# Altium schematic sheet PCB Schematic.SchDoc
size B; SheetNumber: 1; SheetTotal: 1
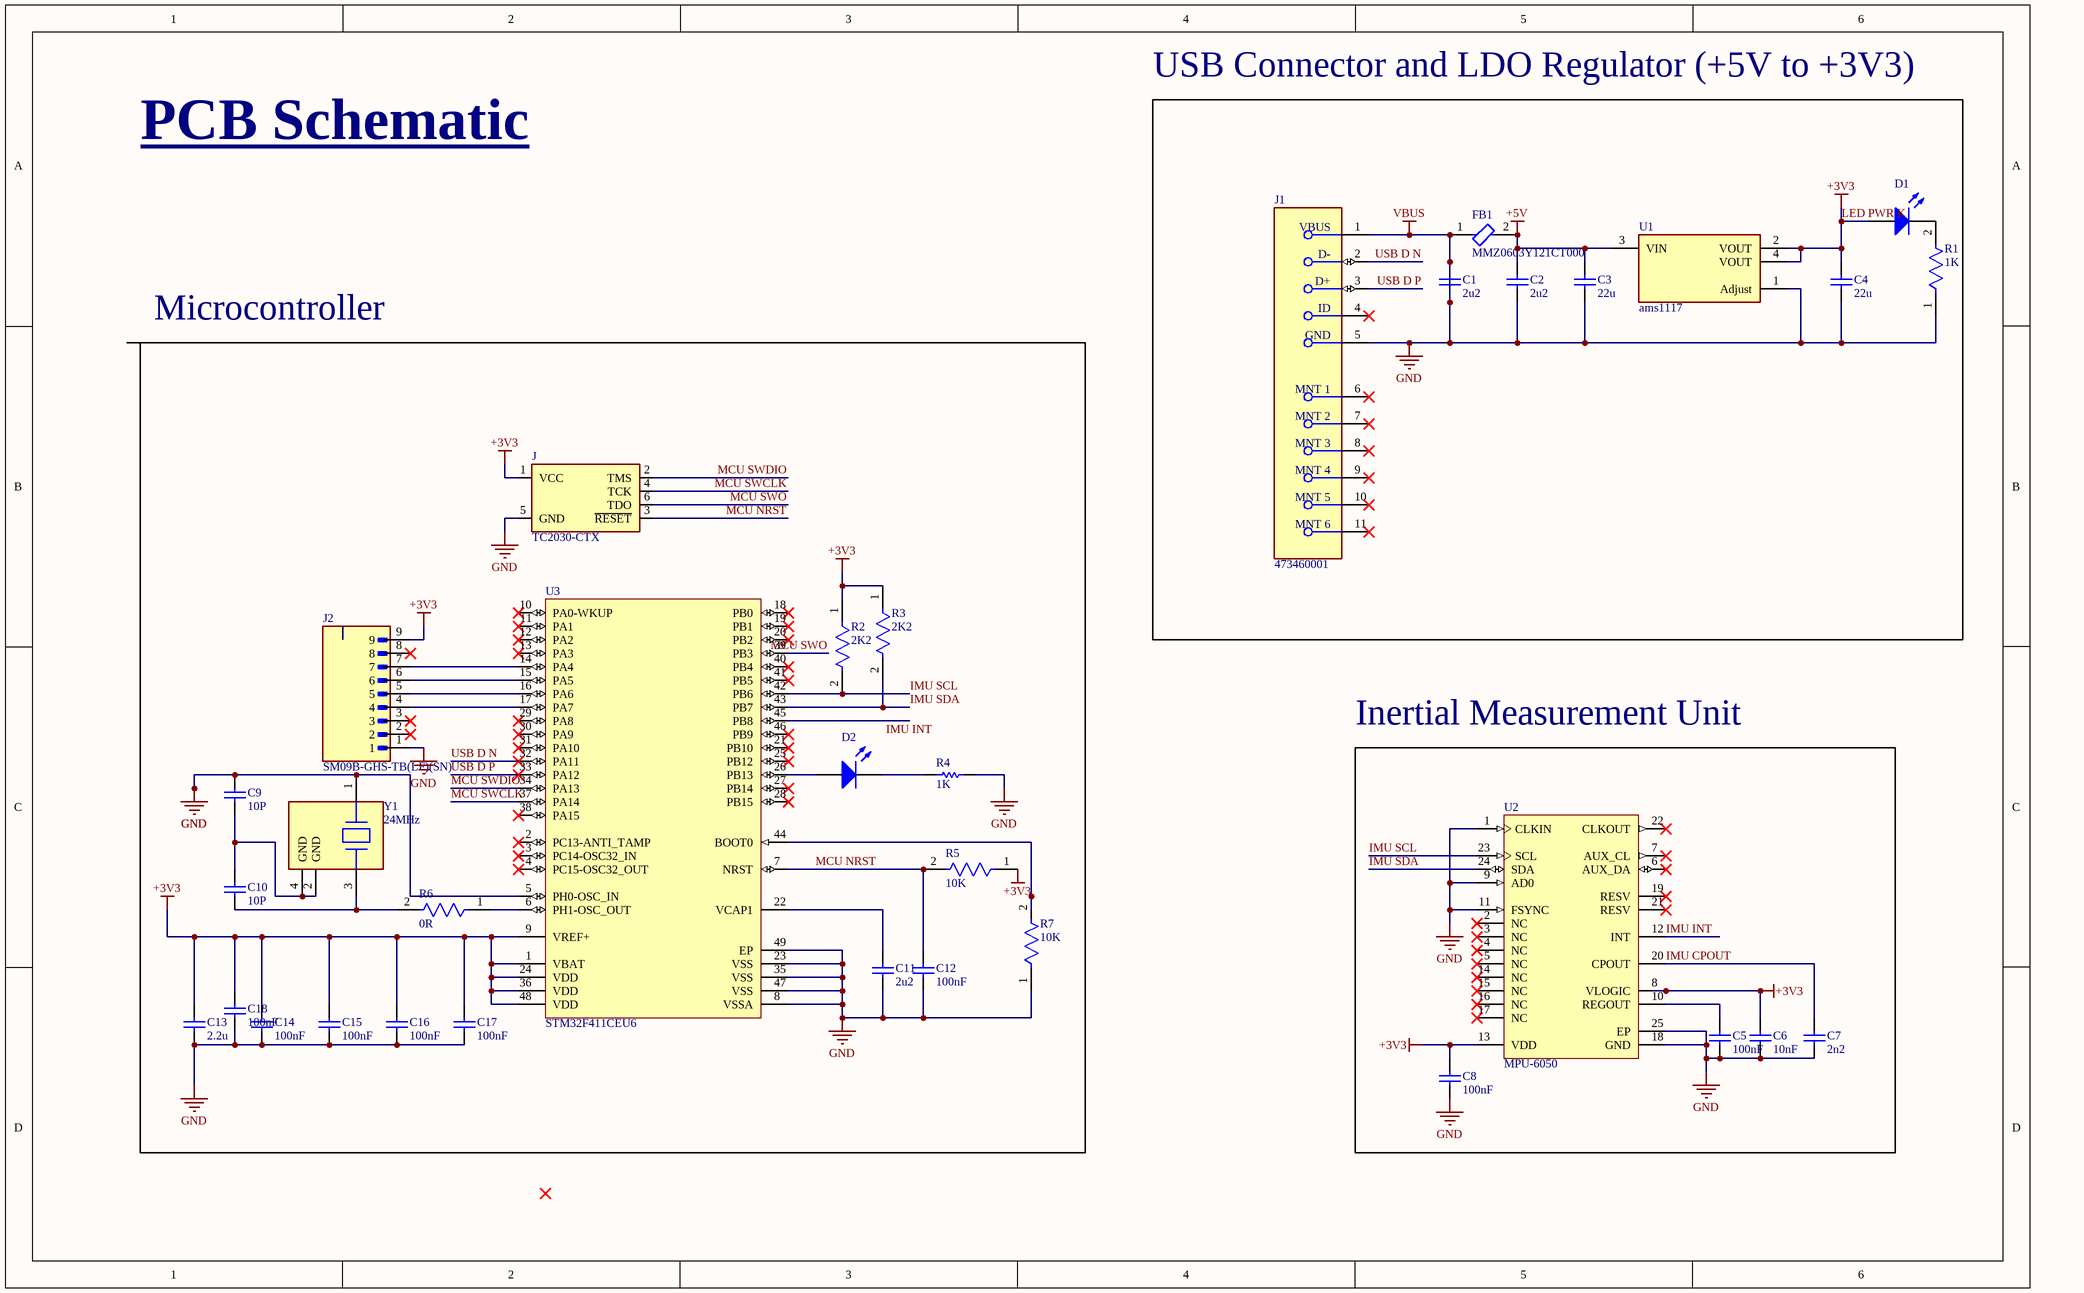
[diagram p0: PCB Schematic.SchDoc]

## Parts
C1  2u2  [CAPC1210(3225)100_L]
C2  2u2  [CAPC1210(3225)100_L]
C3  22u  [CAPC1210(3225)100_L]
C4  22u  [CAPC1210(3225)100_L]
C5  100nF  [CAPC1210(3225)100_L]
C6  10nF  [CAPC1210(3225)100_L]
C7  2n2  [CAPC1210(3225)100_L]
C8  100nF  [CAPC1210(3225)100_L]
C9  10P  [CAPC1210(3225)100_L]
C10  10P  [CAPC1210(3225)100_L]
C11  2u2  [CAPC1210(3225)100_L]
C12  100nF  [CAPC1210(3225)100_L]
C13  2.2u  [CAPC1210(3225)100_L]
C14  100nF  [CAPC1210(3225)100_L]
C15  100nF  [CAPC1210(3225)100_L]
C16  100nF  [CAPC1210(3225)100_L]
C17  100nF  [CAPC1210(3225)100_L]
C18  100nF  [CAPC1210(3225)100_L]
D1  Light-Emitting Diode  (value not drawn)
D2  Light-Emitting Diode  (value not drawn)
FB1  MMZ0603Y121CT000  [FP-MMZ0603-IPC_C]
J  TC2030-CTX  [TC2030-IDC-NL]
J1  473460001  [FP-473460001-MFG]
J2  SM09B-GHS-TB(LF)(SN)  [JST_SM09B-GHS-TB(LF)(SN)]
R1  1K  [FP-AC0603-IPC_A]
R2  2K2  [FP-AC0603-IPC_A]
R3  2K2  [FP-AC0603-IPC_A]
R4  value 1K  (hidden comment: Resistor)
R5  10K  [FP-AC0603-IPC_A]
R6  0R  [FP-AC0603-IPC_A]
R7  10K  [FP-AC0603-IPC_A]
U1  ams1117  [FP-ams1117-IPC_C]
U2  MPU-6050  [IS-QFN-24_V]
U3  STM32F411CEU6  [STM-UFQFPN48_L]
Y1  24MHz  [FP-ABM10AIG-MFG]

## Blocks framed on the sheet
USB Connector and LDO Regulator (+5V to +3V3): C1-C4 D1 FB1 J1 R1 U1
Inertial Measurement Unit: C5-C8 U2

## Nets
+5V: C2.2 C3.2 FB1.2 U1.3(VIN)
GND: C1.1 C1.2 C2.1 C3.1 C4.1 C5.1 C6.1 C7.1 C8.1 C9.1 C11.1 C12.1 C13.1 C14.1 C15.1 C16.1 C17.1 C18.1 FB1.1 J.5(GND) J1.1(VBUS) J1.5(GND) J2.1 R1.1 R4.1 R7.1 U1.1(Adjust) U2.1(CLKIN) U2.9(AD0) U2.11(FSYNC) U2.18(GND) U2.25(EP) U3.5(PH0-OSC_IN) U3.8(VSSA) U3.23(VSS) U3.35(VSS) U3.47(VSS) U3.49(EP) Y1.1(1_Crystal)  [also labelled VBUS]
LED PWR K: C4.2 C6.2 C8.2 C13.2 C14.2 C15.2 C16.2 C17.2 C18.2 D1.1(A) J.1(VCC) J2.9 R2.1 R3.1 R5.1 U1.2(VOUT) U1.4(VOUT) U2.8(VLOGIC) U2.13(VDD) U3.1(VBAT) U3.9(VREF+) U3.24(VDD) U3.36(VDD) U3.48(VDD)  [also labelled +3V3]
IMU CPOUT: C7.2 U2.20(CPOUT)
IMU INT: U2.12(INT) U3.45(PB8)
IMU SCL: R2.2 U2.23(SCL) U3.42(PB6)
IMU SDA: R3.2 U2.24(SDA) U3.43(PB7)
MCU NRST: C12.2 J.3(~{RESET}) R5.2 U3.7(NRST)
MCU SWCLK: J.4(TCK) U3.37(PA14)
MCU SWDIO: J.2(TMS) U3.34(PA13)
MCU SWO: J.6(TDO) U3.39(PB3)
USB D N: J1.2(D-) U3.32(PA11)
USB D P: J1.3(D+) U3.33(PA12)
NetC5_2: C5.2 U2.10(REGOUT)
NetC9_2: C9.2 C10.1 Y1.2(GND) Y1.4(GND)
NetC10_2: C10.2 R6.2 Y1.3(2_Crystal)
NetC11_2: C11.2 U3.22(VCAP1)
NetD1_2: D1.2(K) R1.2
NetD2_1: D2.1(A) U3.26(PB13)
NetD2_2: D2.2(K) R4.2
NetJ2_4: J2.4 U3.17(PA7)
NetJ2_5: J2.5 U3.16(PA6)
NetJ2_6: J2.6 U3.15(PA5)
NetJ2_7: J2.7 U3.14(PA4)
NetR6_1: R6.1 U3.6(PH1-OSC_OUT)
NetR7_2: R7.2 U3.44(BOOT0)

Not connected (* = marked no-connect by the designer): J1 4(ID)* 6(MNT_1)* 7(MNT_2)* 8(MNT_3)* 9(MNT_4)* 10(MNT_5)* 11(MNT_6)*; J2 2* 3* 8*; U2 2(NC)* 3(NC)* 4(NC)* 5(NC)* 6(AUX_DA)* 7(AUX_CL)* 14(NC)* 15(NC)* 16(NC)* 17(NC)* 19(RESV)* 21(RESV)* 22(CLKOUT)*; U3 2(PC13-ANTI_TAMP)* 3(PC14-OSC32_IN)* 4(PC15-OSC32_OUT)* 10(PA0-WKUP)* 11(PA1)* 12(PA2)* 13(PA3)* 18(PB0)* 19(PB1)* 20(PB2)* 21(PB10)* 25(PB12)* 27(PB14)* 28(PB15)* 29(PA8)* 30(PA9)* 31(PA10)* 38(PA15)* 40(PB4)* 41(PB5)* 46(PB9)*

## Notes on the sheet
- PCB Schematic
- Microcontroller

## Library data of the parts
C1-C8 C11 C12 C17 = CMP-1038-01633-2: CAP 100nF 16V ±5% 1210 (3225 Metric) Thickness 1mm SMD; Case-EIA: 1210; Tolerance: Â±5%; Case-Metric: 3225; Value: 100nF; Max Thickness: 1 mm; Technology: SMT; Rated Voltage: 16 V
C9 C10 = CMP-1038-01633-2: 2.2u; Value: 100nF; Case-EIA: 1210; Rated Voltage: 16 V; Tolerance: Â±5%; Case-Metric: 3225; Max Thickness: 1 mm; Technology: SMT
C13 = CMP-1038-01633-2: Value: 100nF; Case-EIA: 1210; Rated Voltage: 16 V; Tolerance: Â±5%; Case-Metric: 3225; Max Thickness: 1 mm; Technology: SMT
C14-C16 C18 = CMP-1038-01633-2: Case-EIA: 1210; Rated Voltage: 16 V; Tolerance: Â±5%; Case-Metric: 3225; Value: 100nF; Max Thickness: 1 mm; Technology: SMT
D1 D2 = LED: AF: 1; BV: 0; BV_MAX: 1e99; EG: 1.11; FC: 0.5; IBV: 0.001; IS: 1e-14; MJSW: 0.33; NTUN: 30; TNOM: 27; XTI: 3; SimulationGenericComponent: True; CJO: 0; CJP: 0; CTA: 0; CTP: 0; FCS: 0.5; FV_MAX: 1e99; IKF: 0; IKR: 0; ISR: 1e-14; JSW: 0; JTUN: 0; JTUNSW: 0; KEG: 1; KF: 0; LEVEL: 1; N: 1; NBV: 1; NR: 1; NS: 1; PHP: 1; RS: 0; TCV: 0; TLEV: 0; TLEVC: 0; TM1: 0; TM2: 0; TPB: 0; TPHP: 0; TRS: 0; TRS2: 0; TT: 0; TTT1: 0; TTT2: 0; VJ: 1; XTITUN: 3
FB1 = CMP-08257-000121-1: Signal Line Ferrite Bead 120Ω @ 100MHz 200mA DCR 390mΩ SMD 0201; Tolerance: 25%; Impedance: 120R; DC Resistance (DCR): 750mR; Core Material: Ferrite; Max DC Current: 200mA; Case/Package: 0201; Packaging: Tape and Reel; Height: 0.013inch; Case Code (Imperial): 0201; Case Code (Metric): 0603; Package Quantity: 15000; Length: 0.024inch; Current Rating: 200mA; Mount: Surface Mount; Width: 0.012inch
J = TC2030-CTX: CortexÂ® Plug-Of-Nailsâ„¢ Adapter Cable; MF: Tag-Connect LLC; Availability: Unavailable; Package: None; MP: TC2030-CTX; SnapEDA_Link: https://www.snapeda.com/parts/TC2030-CTX/Tag-Connect%20LLC/view-part/225831/?ref=snap; Value: *; Price: None
J1 = CMP-2000-05246-2: CONN RCPT USB2.0 MICRO B SMD R/A; Manufacturer: Molex; Conn Orientation: Right Angle; Is Female: yes; Shielding: true; Pitch: 0.65mm; Number Of Contacts: 5; Description: USB - micro B USB 2.0 Receptacle Connector 5 Position Surface Mount, Right Angle; Voltage Rating: 30V; Current Rating: 1.8A; Device Class L2: USB Connectors; Digikey Description: CONN RCPT USB2.0 MICRO B SMD R/A; Height: 2.945mm; RoHS: TRUE; ComponentLink2Description: Datasheet; Octopart: https://octopart.com/47346-0001-molex-7164928; Automotive: No; Package: 0; Category: Conn; Device Class L1: Connectors; Usb Standard: USB 2.0; Temperature: -30°C to +85°C; Temperature Range Low: -30°C; Footprint Url: https://www.molex.com/pdm_docs/sd/473460001_sd.pdf; ComponentLink2URL: https://www.molex.com/webdocs/datasheets/pdf/en-us/0473460001_IO_CONNECTORS.pdf; Lead Free: Yes; Manufacturer Part Number: 473460001; Contact Material: Gold,Nickel; Temperature Range High: +85°C; Device Class L3: unset
J2 = SM09B-GHS-TB(LF)(SN): PLUS LOURD, 1,25 MM, 9 DIRECTIONS, SMT, 90 DEGRÃ‰S ; Hauteur : 1,25 mm ; Type de connecteur : Fil-Ã -carte ; Note actuelle : 1A ; TempÃ©rature maximale de fonctionnement : 85Â°C ; Taille maximale des fils AWG : 26AWG ; TempÃ©rature minimale de fonctionnem; MF: JST; SnapEDA_Link: https://www.snapeda.com/parts/SM09B-GHS-TB%20(LF)(SN)/JST/view-part/?ref=snap; Package: None; Value: *; MP: SM09B-GHS-TB (LF)(SN); Check_prices: https://www.snapeda.com/parts/SM09B-GHS-TB%20(LF)(SN)/JST/view-part/?ref=eda
R1-R3 R5-R7 = CMP-03412-040683-1: RES 10kΩ 5.00% 0.2W 0603
R4 = Resistor: TC1: 0; SimulationGenericComponent: True; TC2: 0
U1 = CMP-209535-000002-1: 1A LOW DROPOUT VOLTAGE REGULATOR; RoHS Compliant: Yes
U2 = CMP-1753-00002-2: 3-Axis Gyroscope, Accelerometer and a Digital Motion Processor(TM) (DMP), 2.375 to 3.46 V, -40 to 85 degC, 24-Pin QFN, RoHS, Tape and Reel; Manufacturer: InvenSense; Featured Product: MPU-60506-Axis,IntegratedI²CSolution; Other Names: 1428-1007-2 / MPU6050; Sensor Type: MotionTracking; Online Catalog: MPU-6000™Series; Unit PriceUSD: Digital; Datasheet Version: Rev. 3.3, 05/2012; Category: Sensors,Transducers; Datasheet URL: http://datasheet.octopart.com/MPU-6050-InvenSense-datasheet-14421344.pdf; Family: Multifunction; Standard Package: 5,000; Manufacturer URL: http://www.invensense.com/; Output Type: Digital; Dynamic Catalog: MPU-6000™Series
U3 = CMP-0243-00165-1: ARM Cortex-M4 32-bit MCU+FPU, 512 KB Flash, 128 KB RAM, 36 I/Os, 48-Pin UFQFPN, -40 to 85 degC, Tray; Operating Frequency(F) (Processor speed) (MHz): 100; FLASH Size (Prog) (kB): 512; Internal RAM Size (kB): 128; I/Os (High Current): 36; Supply Voltage(Vcc) min (V): 1.7; Package Reference: 48-Pin Ultra Thin Fine Pitch Quad Flat No-Lead, 7 x 7 x 0.6 mm Body, 0.5 mm Pitch, Exposed Pad; ComponentLink1Description: Manufacturer URL; ComponentLink1URL: http://www.st.com/; Packing: Tray; Package Description: UFQFPN48; Core: ARM Cortex-M4; ComponentLink2Description: Datasheet; ComponentLink2URL: http://www.st.com/st-web-ui/static/active/en/resource/technical/document/datasheet/DM00115249.pdf; DatasheetVersion: Rev. 6; Mounting Technology: Surface Mount
Y1 = CMP-27762-010727-1: Crystal 24MHz ±30ppm 10pF SMD-4 2.5mm x 2mm Automotive; ESR (Equivalent Series Resistance): 60R; Frequency Stability: 50ppm; Min Operating Temperature: -40°C; Frequency: 24MHz; Frequency Tolerance: 30ppm; Packaging: Tape and Reel; Ratings: AEC-Q200; Length: 0.098inch; RoHS Compliant: Yes; Case/Package: SMD/SMT; Load Capacitance: 10pF; Width: 0.079inch; Height: 0.024inch; Mount: Surface Mount; Max Operating Temperature: 105°C